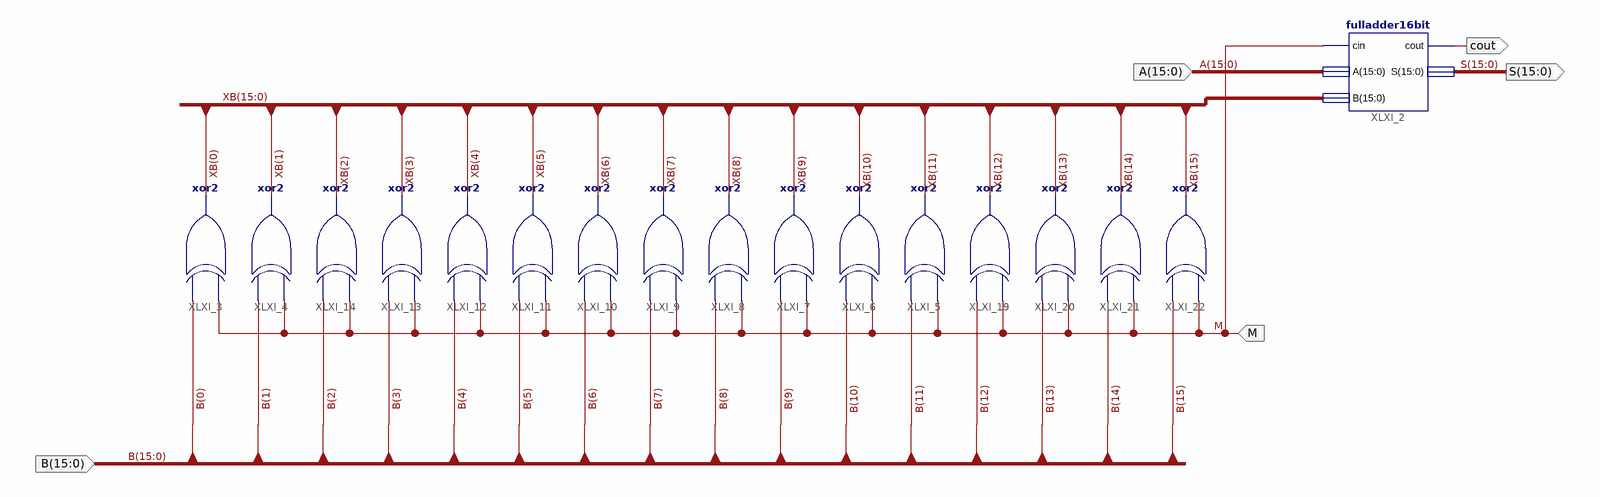
[diagram p0: schematic sheet 1]
// Xilinx ISE schematic two_complement16bitadder.sch (spartan3e) as structural Verilog: 17 symbols, 5 ports
module two_complement16bitadder (
  input  [15:0] B,
  input  M,
  input  [15:0] A,
  output cout,
  output [15:0] S
);

  wire [15:0] XB;

  xor XLXI_22 (XB[15], M, B[15]);
  xor XLXI_21 (XB[14], M, B[14]);
  xor XLXI_20 (XB[13], M, B[13]);
  xor XLXI_19 (XB[12], M, B[12]);
  xor XLXI_5 (XB[11], M, B[11]);
  xor XLXI_6 (XB[10], M, B[10]);
  xor XLXI_7 (XB[9], M, B[9]);
  xor XLXI_8 (XB[8], M, B[8]);
  xor XLXI_9 (XB[7], M, B[7]);
  xor XLXI_10 (XB[6], M, B[6]);
  xor XLXI_11 (XB[5], M, B[5]);
  xor XLXI_12 (XB[4], M, B[4]);
  xor XLXI_13 (XB[3], M, B[3]);
  xor XLXI_14 (XB[2], M, B[2]);
  xor XLXI_4 (XB[1], M, B[1]);
  xor XLXI_3 (XB[0], M, B[0]);
  fulladder16bit XLXI_2 (.A(A), .B(XB), .cin(M), .cout(cout), .S(S));
endmodule
